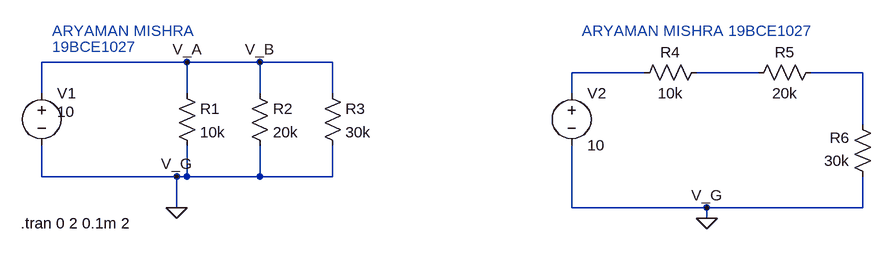
[diagram p0: schematic Draft1.asc]
Draft1.asc, the LTspice schematic file:
Version 4
SHEET 1 1540 680
WIRE 480 80 256 80
WIRE 592 80 480 80
WIRE 704 80 592 80
WIRE 1184 96 1072 96
WIRE 1360 96 1264 96
WIRE 1520 96 1440 96
WIRE 256 128 256 80
WIRE 480 128 480 80
WIRE 592 128 592 80
WIRE 704 128 704 80
WIRE 1072 128 1072 96
WIRE 1520 176 1520 96
WIRE 256 256 256 208
WIRE 464 256 256 256
WIRE 480 256 480 208
WIRE 480 256 464 256
WIRE 592 256 592 208
WIRE 592 256 480 256
WIRE 704 256 704 208
WIRE 704 256 592 256
WIRE 464 304 464 256
WIRE 1072 304 1072 208
WIRE 1280 304 1072 304
WIRE 1520 304 1520 256
WIRE 1520 304 1280 304
WIRE 1280 320 1280 304
FLAG 464 304 0
FLAG 1280 320 0
FLAG 464 256 V_G
FLAG 480 80 V_A
FLAG 592 80 V_B
FLAG 1280 304 V_G
SYMBOL voltage 256 112 R0
WINDOW 3 24 44 Left 2
WINDOW 123 0 0 Left 0
WINDOW 39 0 0 Left 0
SYMATTR Value 10
SYMATTR InstName V1
SYMBOL res 464 112 R0
SYMATTR InstName R1
SYMATTR Value 10k
SYMBOL res 576 112 R0
SYMATTR InstName R2
SYMATTR Value 20k
SYMBOL res 688 112 R0
SYMATTR InstName R3
SYMATTR Value 30k
SYMBOL voltage 1072 112 R0
WINDOW 123 0 0 Left 0
WINDOW 39 0 0 Left 0
SYMATTR InstName V2
SYMATTR Value 10
SYMBOL res 1280 80 R90
WINDOW 0 0 56 VBottom 2
WINDOW 3 32 56 VTop 2
SYMATTR InstName R4
SYMATTR Value 10k
SYMBOL res 1456 80 R90
WINDOW 0 0 56 VBottom 2
WINDOW 3 32 56 VTop 2
SYMATTR InstName R5
SYMATTR Value 20k
SYMBOL res 1536 272 R180
WINDOW 0 36 76 Left 2
WINDOW 3 36 40 Left 2
SYMATTR InstName R6
SYMATTR Value 30k
TEXT 272 56 Left 2 ;19BCE1027
TEXT 224 328 Left 2 !.tran 0 2 0.1m 2
TEXT 272 32 Left 2 ;ARYAMAN MISHRA
TEXT 1088 32 Left 2 ;ARYAMAN MISHRA 19BCE1027

The netlist it stands for:
* Draft1.asc
V1 V_B 0 10
R1 V_B 0 10k
R2 V_B 0 20k
R3 V_B 0 30k
V2 N001 0 10
R4 N002 N001 10k
R5 N003 N002 20k
R6 0 N003 30k
* 19BCE1027
.tran 0 2 0.1m 2
* ARYAMAN MISHRA
* ARYAMAN MISHRA 19BCE1027
.backanno
.end